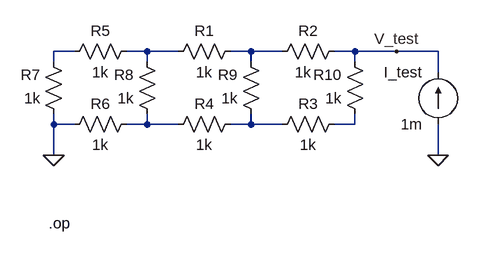
[diagram p0: schematic q2a_mesh_2.asc]
q2a_mesh_2.asc, the LTspice schematic file:
Version 4
SHEET 1 880 680
WIRE 16 128 -16 128
WIRE 128 128 96 128
WIRE 176 128 128 128
WIRE 288 128 256 128
WIRE 336 128 288 128
WIRE 448 128 416 128
WIRE 512 128 448 128
WIRE 576 128 512 128
WIRE -16 144 -16 128
WIRE 128 144 128 128
WIRE 288 144 288 128
WIRE 448 144 448 128
WIRE 576 160 576 128
WIRE -16 240 -16 224
WIRE 16 240 -16 240
WIRE 128 240 128 224
WIRE 128 240 96 240
WIRE 176 240 128 240
WIRE 288 240 288 224
WIRE 288 240 256 240
WIRE 336 240 288 240
WIRE 448 240 448 224
WIRE 448 240 416 240
WIRE -16 288 -16 240
WIRE 576 288 576 240
FLAG -16 288 0
FLAG 576 288 0
FLAG 512 128 V_test
SYMBOL res 112 112 R90
WINDOW 0 0 56 VBottom 2
WINDOW 3 32 56 VTop 2
SYMATTR InstName R5
SYMATTR Value 1k
SYMBOL current 576 240 R180
WINDOW 0 24 80 Left 2
WINDOW 3 24 0 Left 2
SYMATTR InstName I_test
SYMATTR Value 1m
SYMBOL res 272 112 R90
WINDOW 0 0 56 VBottom 2
WINDOW 3 32 56 VTop 2
SYMATTR InstName R1
SYMATTR Value 1k
SYMBOL res 432 112 R90
WINDOW 0 0 56 VBottom 2
WINDOW 3 32 64 VTop 2
SYMATTR InstName R2
SYMATTR Value 1k
SYMBOL res 432 224 R90
WINDOW 0 0 56 VBottom 2
WINDOW 3 32 56 VTop 2
SYMATTR InstName R3
SYMATTR Value 1k
SYMBOL res 272 224 R90
WINDOW 0 0 56 VBottom 2
WINDOW 3 32 56 VTop 2
SYMATTR InstName R4
SYMATTR Value 1k
SYMBOL res 112 224 R90
WINDOW 0 0 56 VBottom 2
WINDOW 3 32 56 VTop 2
SYMATTR InstName R6
SYMATTR Value 1k
SYMBOL res 0 240 R180
WINDOW 0 36 76 Left 2
WINDOW 3 36 40 Left 2
SYMATTR InstName R7
SYMATTR Value 1k
SYMBOL res 144 240 R180
WINDOW 0 36 76 Left 2
WINDOW 3 36 40 Left 2
SYMATTR InstName R8
SYMATTR Value 1k
SYMBOL res 304 240 R180
WINDOW 0 36 76 Left 2
WINDOW 3 36 40 Left 2
SYMATTR InstName R9
SYMATTR Value 1k
SYMBOL res 464 240 R180
WINDOW 0 36 76 Left 2
WINDOW 3 36 40 Left 2
SYMATTR InstName R10
SYMATTR Value 1k
TEXT -24 392 Left 2 !.op

The netlist it stands for:
* q2a_mesh_2.asc
R5 N002 N001 1k
I_test 0 V_test 1m
R1 N003 N002 1k
R2 V_test N003 1k
R3 N006 N005 1k
R4 N005 N004 1k
R6 N004 0 1k
R7 0 N001 1k
R8 N004 N002 1k
R9 N005 N003 1k
R10 N006 V_test 1k
.op
.backanno
.end